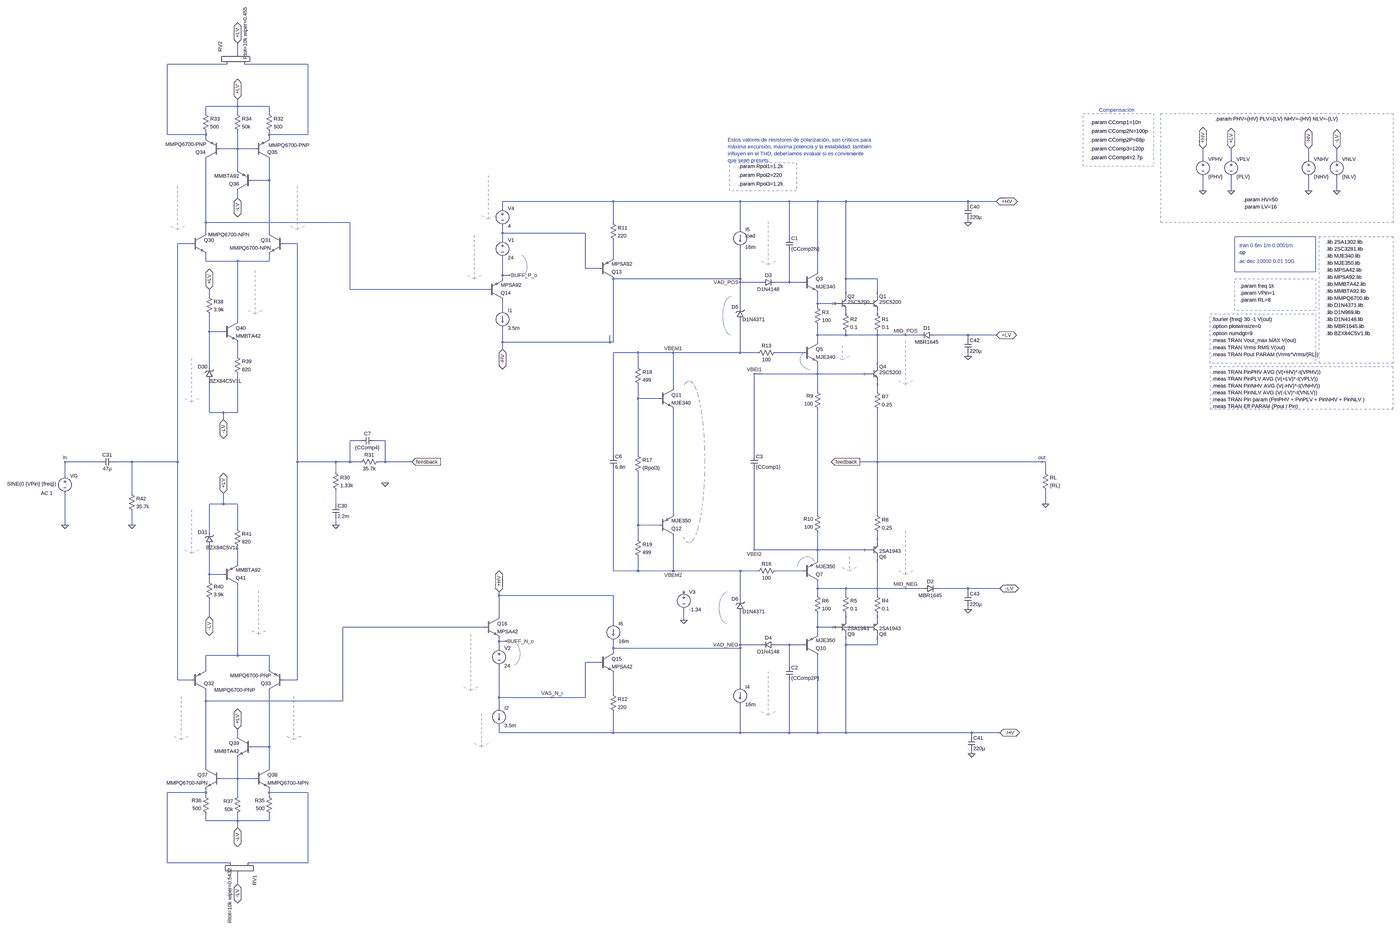
[diagram p0: schematic amplifier_V0.6_Test2.asc, whole sheet]
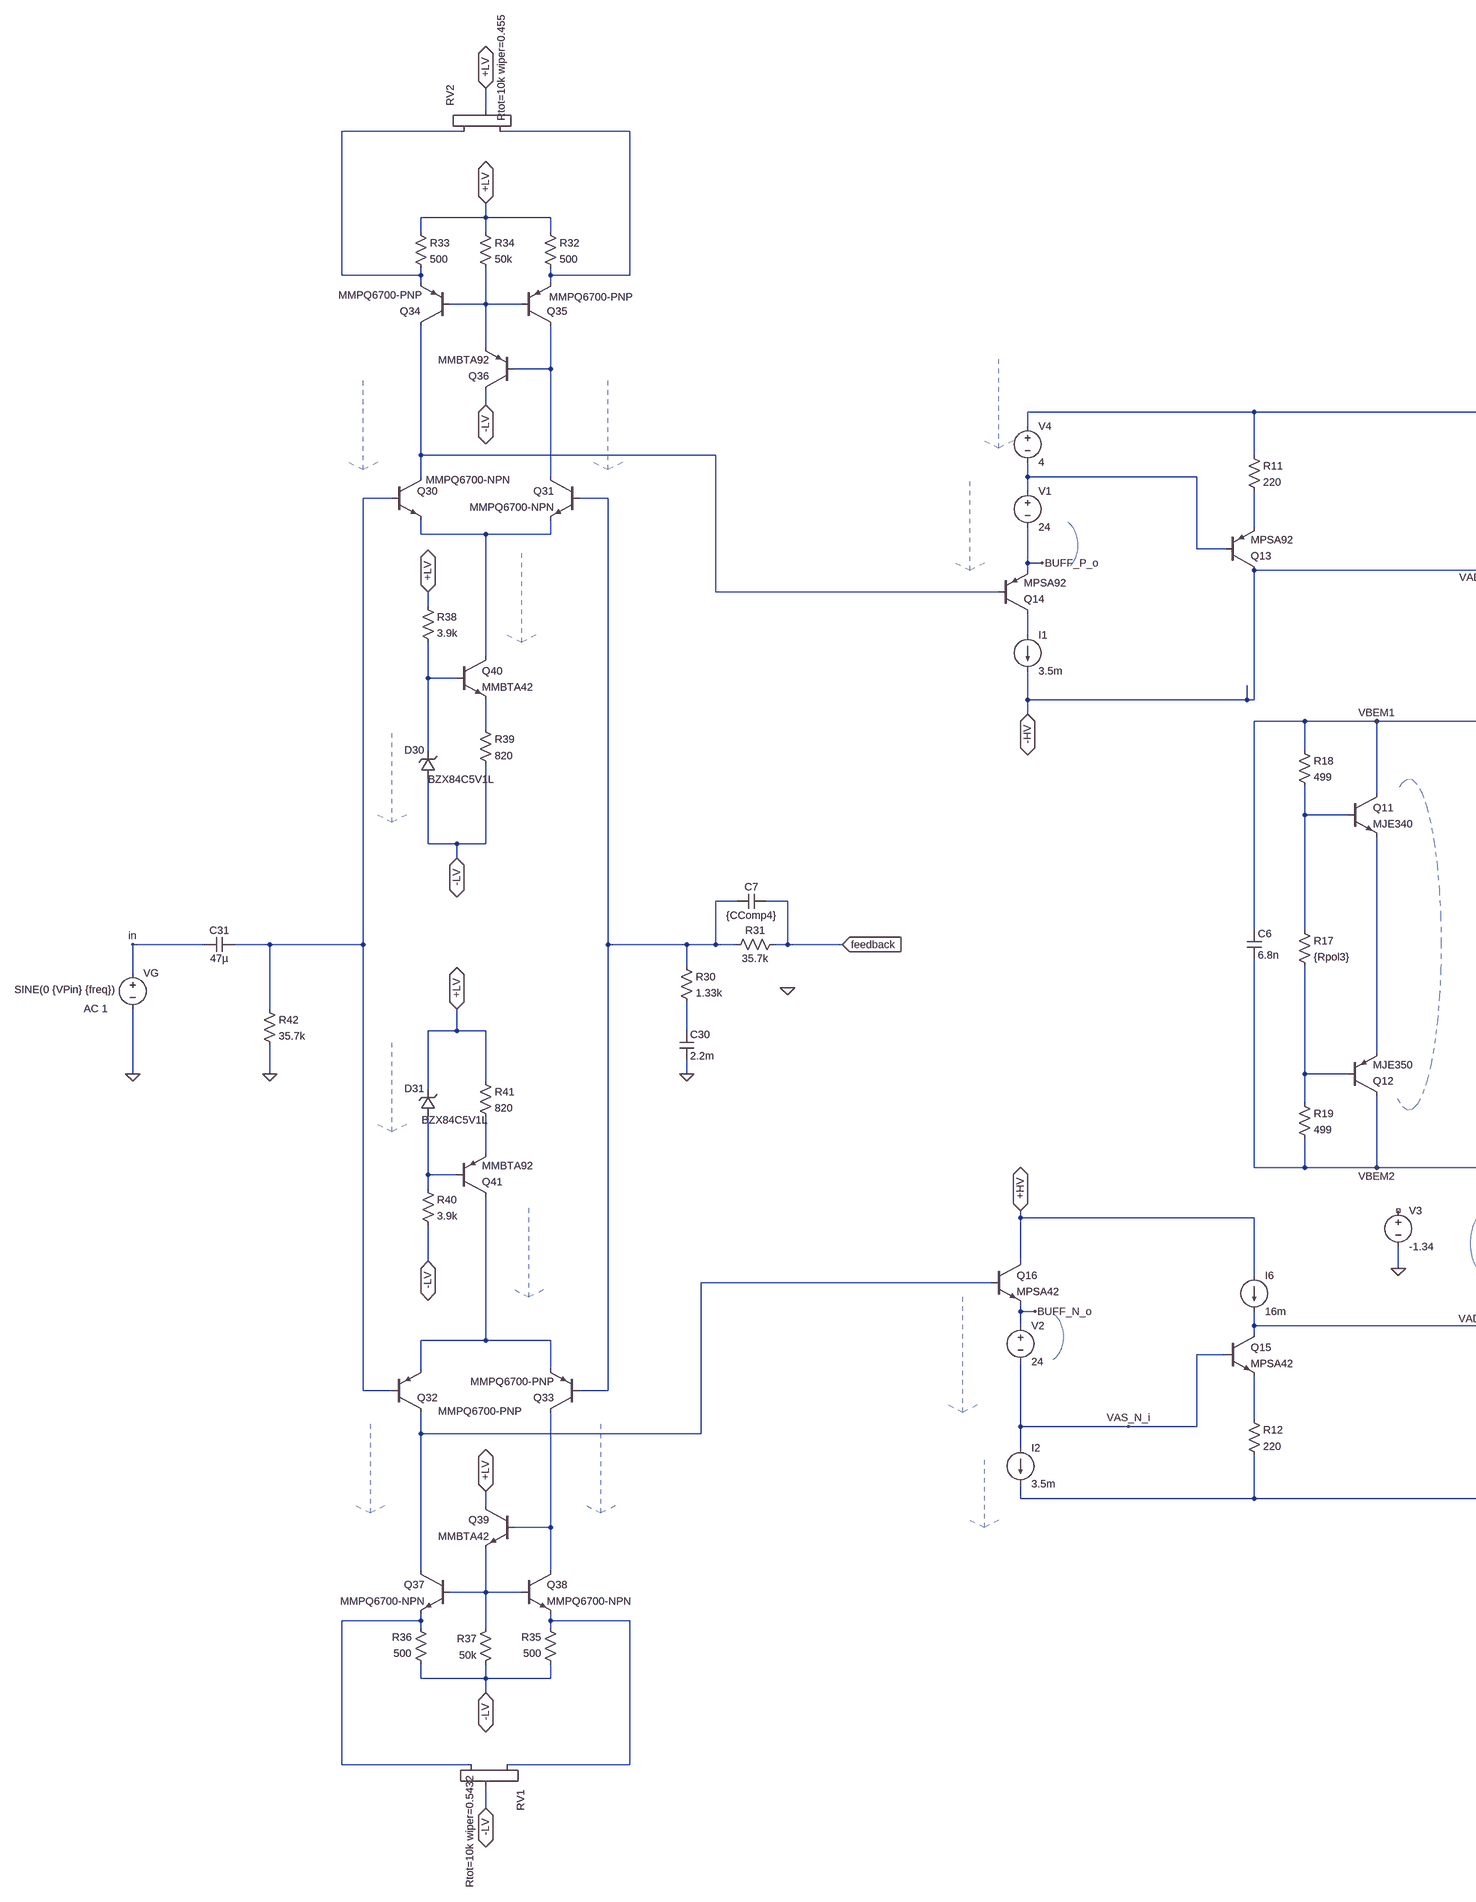
[diagram p1: schematic amplifier_V0.6_Test2.asc, part, row 1 of 1, column 1 of 2]
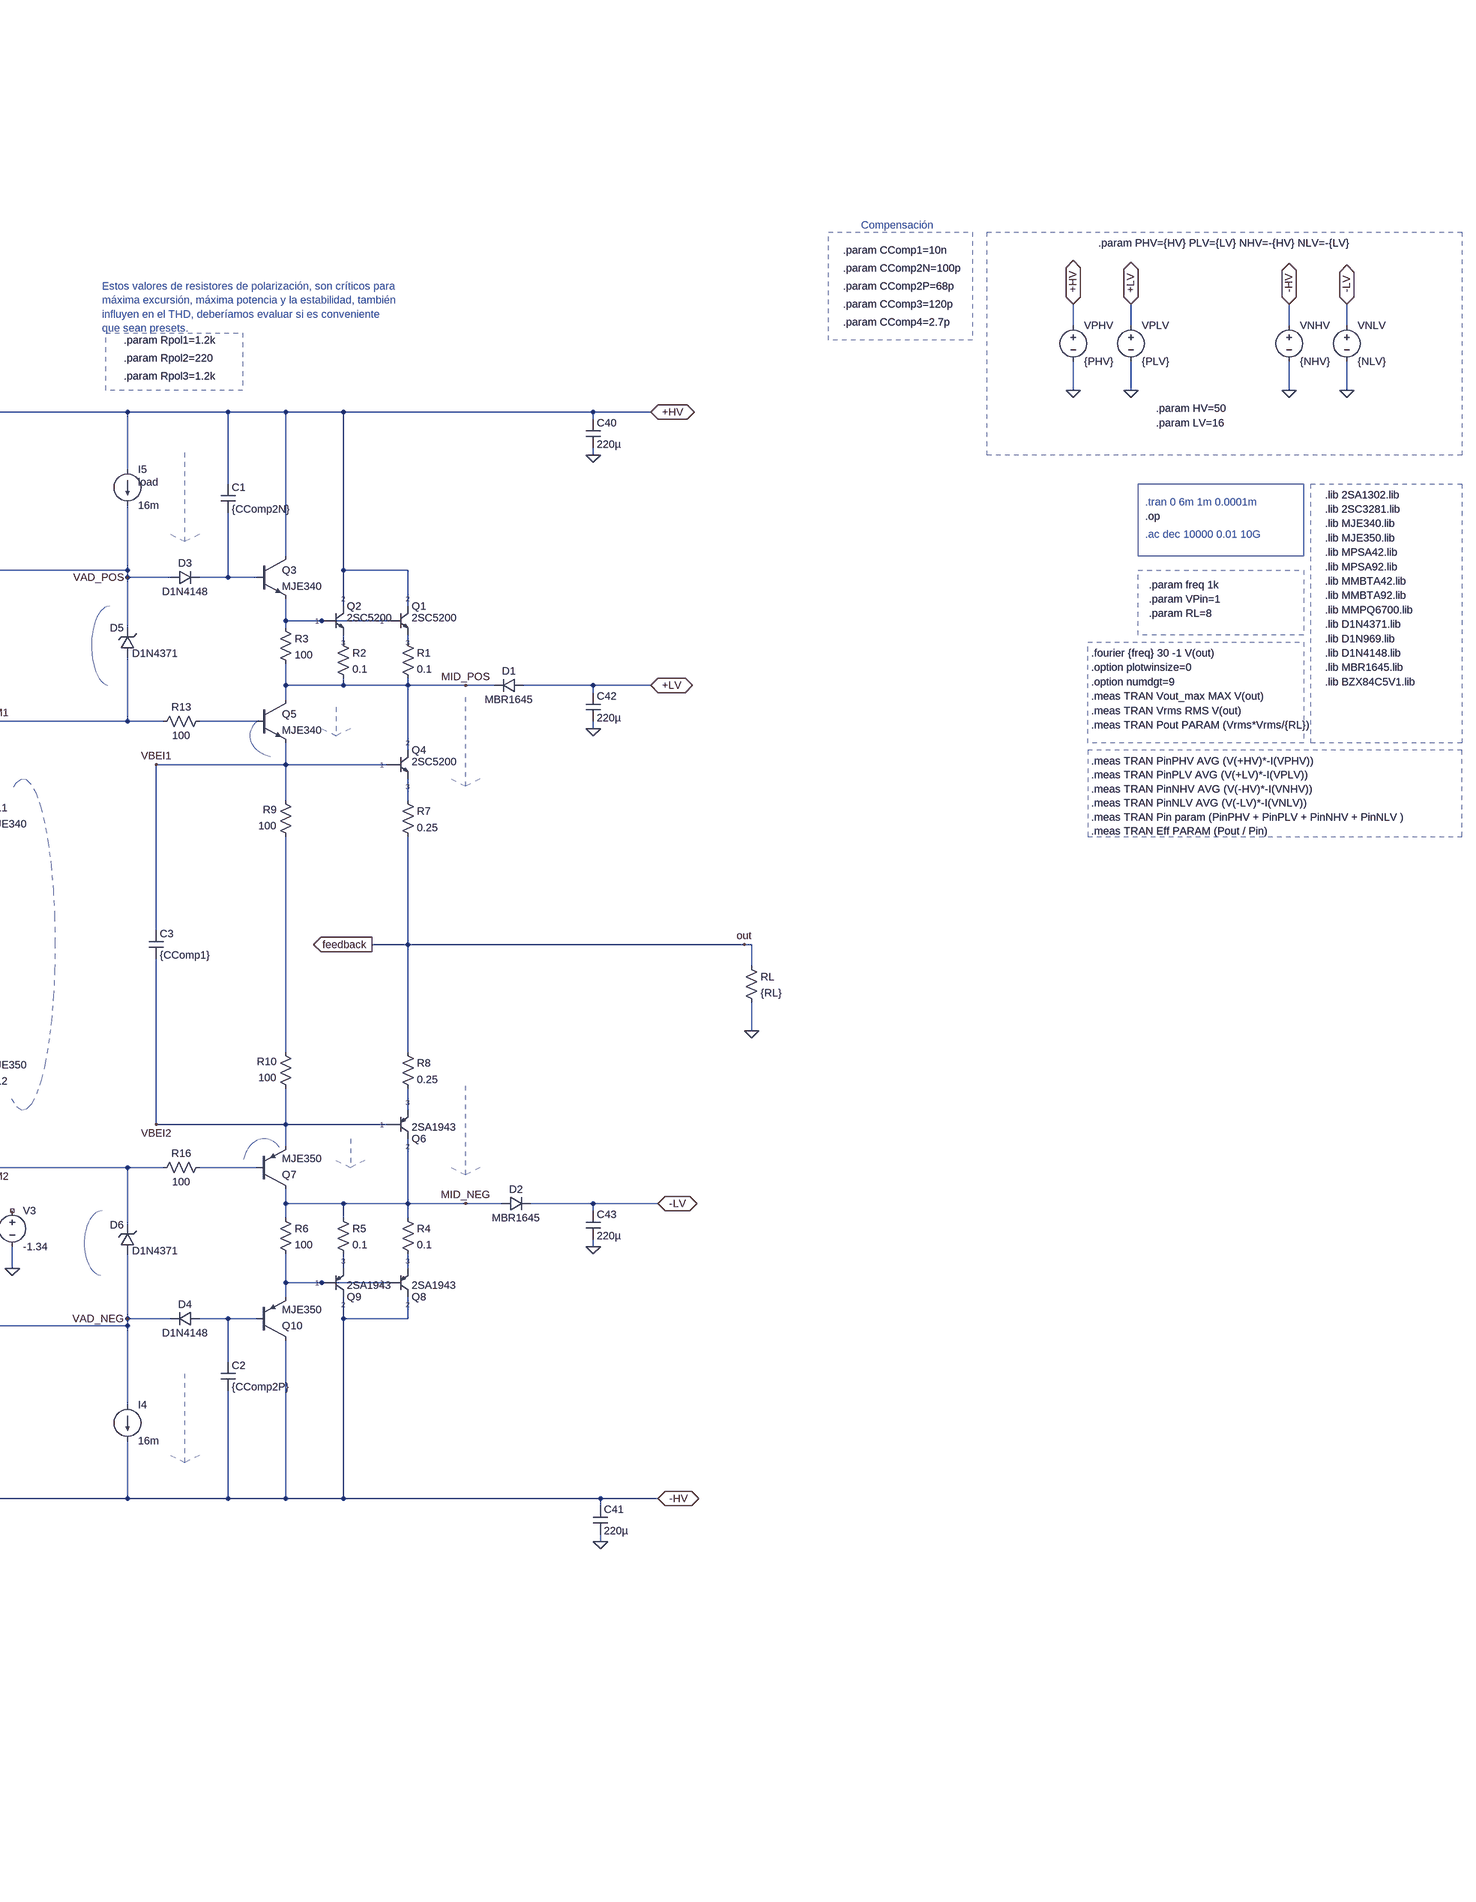
[diagram p2: schematic amplifier_V0.6_Test2.asc, part, row 1 of 1, column 2 of 2]
amplifier_V0.6_Test2.asc, the LTspice schematic file:
Version 4
SHEET 1 5124 2324
WIRE -2016 -1728 -2016 -1776
WIRE -2064 -1680 -2336 -1680
WIRE -1696 -1680 -1984 -1680
WIRE -2016 -1488 -2016 -1520
WIRE -2016 -1488 -2160 -1488
WIRE -1872 -1488 -2016 -1488
WIRE -2160 -1456 -2160 -1488
WIRE -2016 -1456 -2016 -1488
WIRE -1872 -1456 -1872 -1488
WIRE -2336 -1360 -2336 -1680
WIRE -2160 -1360 -2160 -1376
WIRE -2160 -1360 -2336 -1360
WIRE -1872 -1360 -1872 -1376
WIRE -1696 -1360 -1696 -1680
WIRE -1696 -1360 -1872 -1360
WIRE -2160 -1344 -2160 -1360
WIRE -1872 -1344 -1872 -1360
WIRE -2016 -1296 -2016 -1376
WIRE -2016 -1296 -2096 -1296
WIRE -1936 -1296 -2016 -1296
WIRE 4256 -1248 4256 -1296
WIRE 4384 -1248 4384 -1296
WIRE 4736 -1248 4736 -1296
WIRE 4864 -1248 4864 -1296
WIRE -2016 -1200 -2016 -1296
WIRE -1872 -1152 -1872 -1248
WIRE -1872 -1152 -1952 -1152
WIRE 4256 -1104 4256 -1168
WIRE 4384 -1104 4384 -1168
WIRE 4736 -1104 4736 -1168
WIRE 4864 -1104 4864 -1168
WIRE -2016 -1072 -2016 -1104
WIRE -128 -1056 -640 -1056
WIRE 448 -1056 -128 -1056
WIRE 672 -1056 448 -1056
WIRE 800 -1056 672 -1056
WIRE 928 -1056 800 -1056
WIRE 1712 -1056 928 -1056
WIRE 1840 -1056 1712 -1056
WIRE 1712 -1040 1712 -1056
WIRE -640 -1024 -640 -1056
WIRE -2160 -960 -2160 -1248
WIRE -1472 -960 -2160 -960
WIRE -128 -960 -128 -1056
WIRE 1712 -960 1712 -976
WIRE 448 -928 448 -1056
WIRE -2160 -912 -2160 -960
WIRE -1872 -912 -1872 -1152
WIRE -640 -912 -640 -944
WIRE -256 -912 -640 -912
WIRE 672 -896 672 -1056
WIRE -640 -880 -640 -912
WIRE -2224 -864 -2288 -864
WIRE -1744 -864 -1808 -864
WIRE -128 -800 -128 -880
WIRE -2160 -784 -2160 -816
WIRE -2016 -784 -2160 -784
WIRE -1872 -784 -1872 -816
WIRE -1872 -784 -2016 -784
WIRE -256 -752 -256 -912
WIRE -192 -752 -256 -752
WIRE 800 -736 800 -1056
WIRE -640 -720 -640 -800
WIRE -608 -720 -640 -720
WIRE -640 -704 -640 -720
WIRE 448 -704 448 -848
WIRE 448 -704 -128 -704
WIRE 928 -704 928 -1056
WIRE 1072 -704 928 -704
WIRE 448 -688 448 -704
WIRE 544 -688 448 -688
WIRE 672 -688 672 -832
WIRE 672 -688 608 -688
WIRE 736 -688 672 -688
WIRE -1472 -656 -1472 -960
WIRE -704 -656 -1472 -656
WIRE -2144 -624 -2144 -656
WIRE 928 -624 928 -704
WIRE 1072 -624 1072 -704
WIRE 800 -592 800 -640
WIRE 880 -592 800 -592
WIRE 1024 -592 880 -592
WIRE 448 -576 448 -688
WIRE 800 -576 800 -592
WIRE -640 -560 -640 -608
WIRE 928 -544 928 -560
WIRE 1072 -544 1072 -560
WIRE -2016 -512 -2016 -784
WIRE -2144 -464 -2144 -544
WIRE -2080 -464 -2144 -464
WIRE 800 -448 800 -496
WIRE 928 -448 928 -464
WIRE 928 -448 800 -448
WIRE 1072 -448 1072 -464
WIRE 1072 -448 928 -448
WIRE 1200 -448 1072 -448
WIRE 1264 -448 1200 -448
WIRE 1712 -448 1328 -448
WIRE 1840 -448 1712 -448
WIRE 1712 -432 1712 -448
WIRE -640 -416 -640 -480
WIRE -144 -416 -144 -448
WIRE -144 -416 -640 -416
WIRE -128 -416 -128 -704
WIRE -128 -416 -144 -416
WIRE 800 -416 800 -448
WIRE -640 -384 -640 -416
WIRE -16 -368 -128 -368
WIRE 144 -368 -16 -368
WIRE 448 -368 448 -512
WIRE 448 -368 144 -368
WIRE 528 -368 448 -368
WIRE 736 -368 608 -368
WIRE -2016 -352 -2016 -416
WIRE 1712 -352 1712 -368
WIRE -2144 -304 -2144 -464
WIRE -16 -304 -16 -368
WIRE 1072 -304 1072 -448
WIRE 800 -272 800 -320
WIRE 800 -272 512 -272
WIRE 1024 -272 800 -272
WIRE 144 -208 144 -368
WIRE 800 -192 800 -272
WIRE 1072 -192 1072 -240
WIRE -16 -160 -16 -224
WIRE 80 -160 -16 -160
WIRE -2144 -96 -2144 -240
WIRE -2080 -96 -2144 -96
WIRE -2016 -96 -2016 -272
WIRE -2016 -96 -2080 -96
WIRE -2080 -64 -2080 -96
WIRE -1424 32 -1472 32
WIRE -1312 32 -1360 32
WIRE -128 96 -128 -368
WIRE -16 96 -16 -160
WIRE 512 96 512 -272
WIRE -2640 128 -2912 128
WIRE -2496 128 -2576 128
WIRE -2288 128 -2288 -864
WIRE -2288 128 -2496 128
WIRE -1744 128 -1744 -864
WIRE -1536 128 -1744 128
WIRE -1472 128 -1472 32
WIRE -1472 128 -1536 128
WIRE -1424 128 -1472 128
WIRE -1312 128 -1312 32
WIRE -1312 128 -1344 128
WIRE -1152 128 -1312 128
WIRE 1072 128 1072 -112
WIRE 1072 128 992 128
WIRE 2048 128 1072 128
WIRE 2064 128 2048 128
WIRE -1536 176 -1536 128
WIRE 2064 176 2064 128
WIRE -2912 192 -2912 128
WIRE -2496 272 -2496 128
WIRE -2080 320 -2080 272
WIRE -2080 320 -2144 320
WIRE -2016 320 -2080 320
WIRE -1536 320 -1536 256
WIRE 2064 320 2064 256
WIRE 144 368 144 -112
WIRE 800 368 800 -112
WIRE 1072 368 1072 128
WIRE -2912 416 -2912 272
WIRE -2496 416 -2496 352
WIRE -1536 416 -1536 384
WIRE -16 416 -16 176
WIRE 80 416 -16 416
WIRE -2016 432 -2016 320
WIRE -2144 448 -2144 320
WIRE -16 480 -16 416
WIRE 1072 496 1072 448
WIRE 512 528 512 160
WIRE 800 528 800 448
WIRE 800 528 512 528
WIRE 1024 528 800 528
WIRE 800 576 800 528
WIRE -2016 592 -2016 512
WIRE -128 624 -128 160
WIRE -16 624 -16 560
WIRE -16 624 -128 624
WIRE 144 624 144 464
WIRE 144 624 -16 624
WIRE 448 624 144 624
WIRE 528 624 448 624
WIRE 736 624 608 624
WIRE -2144 640 -2144 512
WIRE -2080 640 -2144 640
WIRE -2144 672 -2144 640
WIRE 800 704 800 672
WIRE 928 704 800 704
WIRE 1072 704 1072 560
WIRE 1072 704 928 704
WIRE 1200 704 1072 704
WIRE 1280 704 1200 704
WIRE 1712 704 1344 704
WIRE 1856 704 1712 704
WIRE 1712 720 1712 704
WIRE -656 736 -656 720
WIRE -128 736 -656 736
WIRE 800 736 800 704
WIRE 928 736 928 704
WIRE 1072 736 1072 704
WIRE 448 752 448 624
WIRE 1712 800 1712 784
WIRE -2144 832 -2144 752
WIRE -656 832 -656 736
WIRE 192 848 192 800
WIRE 928 848 928 816
WIRE 1072 848 1072 816
WIRE -128 864 -128 736
WIRE -720 880 -1504 880
WIRE 800 880 800 816
WIRE 880 880 800 880
WIRE 1024 880 880 880
WIRE 800 912 800 880
WIRE -656 944 -656 928
WIRE -624 944 -656 944
WIRE 448 960 448 816
WIRE 544 960 448 960
WIRE 672 960 608 960
WIRE 736 960 672 960
WIRE 928 960 928 912
WIRE 1072 960 1072 912
WIRE 1072 960 928 960
WIRE -656 976 -656 944
WIRE -128 976 -128 944
WIRE 448 976 448 960
WIRE 448 976 -128 976
WIRE -128 992 -128 976
WIRE -2016 1008 -2016 688
WIRE -2016 1008 -2160 1008
WIRE -1872 1008 -2016 1008
WIRE -192 1040 -256 1040
WIRE 672 1056 672 960
WIRE -2160 1072 -2160 1008
WIRE -1872 1072 -1872 1008
WIRE -2288 1120 -2288 128
WIRE -2224 1120 -2288 1120
WIRE -1744 1120 -1744 128
WIRE -1744 1120 -1808 1120
WIRE 448 1152 448 976
WIRE -128 1184 -128 1088
WIRE -656 1200 -656 1056
WIRE -416 1200 -656 1200
WIRE -256 1200 -256 1040
WIRE -256 1200 -416 1200
WIRE -2160 1216 -2160 1168
WIRE -1504 1216 -1504 880
WIRE -1504 1216 -2160 1216
WIRE -656 1248 -656 1200
WIRE -656 1360 -656 1328
WIRE -128 1360 -128 1264
WIRE -128 1360 -656 1360
WIRE 448 1360 448 1232
WIRE 448 1360 -128 1360
WIRE 672 1360 672 1120
WIRE 672 1360 448 1360
WIRE 800 1360 800 1008
WIRE 800 1360 672 1360
WIRE 928 1360 928 960
WIRE 928 1360 800 1360
WIRE 1728 1360 928 1360
WIRE 1856 1360 1728 1360
WIRE -2016 1376 -2016 1344
WIRE 1728 1376 1728 1360
WIRE -1872 1424 -1872 1168
WIRE -1872 1424 -1952 1424
WIRE 1728 1456 1728 1440
WIRE -2160 1520 -2160 1216
WIRE -1872 1520 -1872 1424
WIRE -2016 1568 -2016 1472
WIRE -2016 1568 -2096 1568
WIRE -1936 1568 -2016 1568
WIRE -2160 1632 -2160 1616
WIRE -2160 1632 -2336 1632
WIRE -1872 1632 -1872 1616
WIRE -1696 1632 -1872 1632
WIRE -2160 1648 -2160 1632
WIRE -2016 1648 -2016 1568
WIRE -1872 1648 -1872 1632
WIRE -2160 1760 -2160 1728
WIRE -2016 1760 -2016 1728
WIRE -2016 1760 -2160 1760
WIRE -1872 1760 -1872 1728
WIRE -1872 1760 -2016 1760
WIRE -2016 1792 -2016 1760
WIRE -2336 1952 -2336 1632
WIRE -2048 1952 -2336 1952
WIRE -1696 1952 -1696 1632
WIRE -1696 1952 -1968 1952
WIRE -2016 2048 -2016 2000
FLAG 144 -368 VBEM1
FLAG 144 624 VBEM2
FLAG 448 -688 VAD_POS
FLAG 448 960 VAD_NEG
FLAG 1200 704 MID_NEG
FLAG 1200 -448 MID_POS
FLAG 512 -272 VBEI1
FLAG 512 528 VBEI2
FLAG -2496 416 0
FLAG -1536 416 0
FLAG -2016 -1520 +LV
IOPIN -2016 -1520 BiDir
FLAG -2016 1792 -LV
IOPIN -2016 1792 BiDir
FLAG -2016 1344 +LV
IOPIN -2016 1344 BiDir
FLAG -2016 -1072 -LV
IOPIN -2016 -1072 BiDir
FLAG -2144 -656 +LV
IOPIN -2144 -656 BiDir
FLAG -2080 -64 -LV
IOPIN -2080 -64 BiDir
FLAG -2080 272 +LV
IOPIN -2080 272 BiDir
FLAG -2144 832 -LV
IOPIN -2144 832 BiDir
FLAG 1856 1360 -HV
IOPIN 1856 1360 BiDir
FLAG 1856 704 -LV
IOPIN 1856 704 BiDir
FLAG 1840 -1056 +HV
IOPIN 1840 -1056 BiDir
FLAG 1840 -448 +LV
IOPIN 1840 -448 BiDir
FLAG 2064 320 0
FLAG 2048 128 out
FLAG -1152 128 feedback
IOPIN -1152 128 In
FLAG 992 128 feedback
IOPIN 992 128 Out
FLAG -2912 416 0
FLAG -2912 128 in
FLAG -608 -720 BUFF_P_o
FLAG -416 1200 VAS_N_i
FLAG -624 944 BUFF_N_o
FLAG 1712 -960 0
FLAG 1712 -352 0
FLAG 1712 800 0
FLAG 1728 1456 0
FLAG 4256 -1104 0
FLAG 4384 -1104 0
FLAG 4736 -1104 0
FLAG 4864 -1104 0
FLAG 4256 -1296 +HV
IOPIN 4256 -1296 BiDir
FLAG 4384 -1296 +LV
IOPIN 4384 -1296 BiDir
FLAG 4736 -1296 -HV
IOPIN 4736 -1296 BiDir
FLAG 4864 -1296 -LV
IOPIN 4864 -1296 BiDir
FLAG -2016 -1776 +LV
IOPIN -2016 -1776 BiDir
FLAG -2016 2048 -LV
IOPIN -2016 2048 BiDir
FLAG -640 -384 -HV
IOPIN -640 -384 BiDir
FLAG -656 720 +HV
IOPIN -656 720 BiDir
FLAG -1312 224 0
FLAG 192 848 0
DATAFLAG 848 704 "round($*100)/100"
DATAFLAG 1200 -304 "Ix(q4:2)"
DATAFLAG 1200 560 "-Ix(q6:2)"
DATAFLAG 288 128 "V(vbem1)-V(vbem2)"
DATAFLAG 912 -368 "-Ie(Q5)"
DATAFLAG 944 592 "Ie(Q7)"
DATAFLAG 144 -288 "Ic(Q11)"
DATAFLAG 144 544 "Ic(Q12)"
DATAFLAG 368 -496 "V(vad_pos)-V(vbem1)"
DATAFLAG 352 784 "-(V(vad_neg)-V(vbem2))"
DATAFLAG 736 -304 "V(vbem1)-V(vbei1)"
DATAFLAG 720 576 "-(V(vbem2)-V(vbei2))"
DATAFLAG 304 624 ""
DATAFLAG 288 -368 ""
DATAFLAG -768 -800 "Ie(Q14)"
DATAFLAG -528 1120 ""
DATAFLAG -944 -656 ""
DATAFLAG -1008 880 ""
DATAFLAG -1744 -1024 "Ic(Q31)"
DATAFLAG -2288 -1024 "Ic(Q30)"
DATAFLAG -2016 -784 ""
DATAFLAG -2272 1296 "-Ic(Q32)"
DATAFLAG -2016 1008 ""
DATAFLAG -2160 1328 ""
DATAFLAG -1760 1296 "-Ic(Q33)"
DATAFLAG -1872 1344 ""
DATAFLAG -2160 -1040 ""
DATAFLAG -1872 -1040 ""
DATAFLAG -2000 -1296 ""
DATAFLAG 1952 128 ""
DATAFLAG -2144 -480 ""
DATAFLAG -2016 -400 ""
DATAFLAG 800 144 ""
DATAFLAG -1584 128 ""
DATAFLAG -560 1008 "-V(VAS_N_i)+V(BUFF_N_o)"
DATAFLAG -1936 -640 "Ic(Q40)"
DATAFLAG -1920 816 "-Ic(Q41)"
DATAFLAG 800 -592 ""
DATAFLAG 672 960 ""
DATAFLAG -784 1008 "-Ie(Q16)"
DATAFLAG 144 80 ""
DATAFLAG -2224 -240 "Ix(D30:-)"
DATAFLAG -2224 448 "Ix(D31:-)"
DATAFLAG -2128 640 ""
DATAFLAG -704 -1072 "I(R12)"
DATAFLAG -736 1376 "I(R15)"
DATAFLAG -1248 128 ""
DATAFLAG 368 -1056 ""
DATAFLAG 576 -864 "Ic(Q17)"
DATAFLAG 240 1360 ""
DATAFLAG -560 1200 "Ib(Q15)"
DATAFLAG 576 1184 "-Ic(Q18)"
DATAFLAG 176 -720 "-Ic(Q13)"
DATAFLAG -320 -912 ""
DATAFLAG 320 -640 "V(VAD_POS)"
DATAFLAG -480 -960 "Ib(Q13)"
DATAFLAG -128 -688 ""
DATAFLAG -128 -848 ""
SYMBOL npn 736 -736 R0
SYMATTR InstName Q3
SYMATTR Value MJE340
SYMBOL res 784 -592 R0
SYMATTR InstName R3
SYMATTR Value 100
SYMBOL diode 544 -672 R270
WINDOW 0 32 32 VTop 2
WINDOW 3 0 32 VBottom 2
SYMATTR InstName D3
SYMATTR Value D1N4148
SYMBOL npn 736 -416 R0
SYMATTR InstName Q5
SYMATTR Value MJE340
SYMBOL res 1056 -208 R0
SYMATTR InstName R7
SYMATTR Value 0.25
SYMBOL res 816 -96 R180
WINDOW 0 36 76 Left 2
WINDOW 3 36 40 Left 2
SYMATTR InstName R9
SYMATTR Value 100
SYMBOL res 1056 352 R0
SYMATTR InstName R8
SYMATTR Value 0.25
SYMBOL pnp 736 672 M180
SYMATTR InstName Q7
SYMATTR Value MJE350
SYMBOL pnp 736 1008 M180
SYMATTR InstName Q10
SYMATTR Value MJE350
SYMBOL res 784 720 R0
SYMATTR InstName R6
SYMATTR Value 100
SYMBOL diode 608 944 R90
WINDOW 0 0 32 VBottom 2
WINDOW 3 32 32 VTop 2
SYMATTR InstName D4
SYMATTR Value D1N4148
SYMBOL diode 1280 720 R270
WINDOW 0 32 32 VTop 2
WINDOW 3 0 32 VBottom 2
SYMATTR InstName D2
SYMATTR Value MBR1645
SYMBOL res 816 464 R180
WINDOW 0 36 76 Left 2
WINDOW 3 36 40 Left 2
SYMATTR InstName R10
SYMATTR Value 100
SYMBOL res 1056 720 R0
SYMATTR InstName R4
SYMATTR Value 0.1
SYMBOL res 912 720 R0
SYMATTR InstName R5
SYMATTR Value 0.1
SYMBOL res 912 -560 R0
SYMATTR InstName R2
SYMATTR Value 0.1
SYMBOL res 1056 -560 R0
SYMATTR InstName R1
SYMATTR Value 0.1
SYMBOL diode 1328 -432 M270
WINDOW 0 32 32 VTop 2
WINDOW 3 0 32 VBottom 2
SYMATTR InstName D1
SYMATTR Value MBR1645
SYMBOL pnp 80 464 M180
SYMATTR InstName Q12
SYMATTR Value MJE350
SYMBOL npn 80 -208 R0
SYMATTR InstName Q11
SYMATTR Value MJE340
SYMBOL res -32 80 R0
SYMATTR InstName R17
SYMATTR Value {Rpol3}
SYMBOL res -32 -320 R0
SYMATTR InstName R18
SYMATTR Value 499
SYMBOL res -32 464 R0
SYMATTR InstName R19
SYMATTR Value 499
SYMBOL cap 496 96 R0
SYMATTR InstName C3
SYMATTR Value {CComp1}
SYMBOL res 624 -384 R90
WINDOW 0 0 56 VBottom 2
WINDOW 3 32 56 VTop 2
SYMATTR InstName R13
SYMATTR Value 100
SYMBOL res 624 608 R90
WINDOW 0 0 56 VBottom 2
WINDOW 3 32 56 VTop 2
SYMATTR InstName R16
SYMATTR Value 100
SYMBOL cap -144 96 R0
SYMATTR InstName C6
SYMATTR Value 6.8n
SYMBOL npn -720 832 R0
SYMATTR InstName Q16
SYMATTR Value MPSA42
SYMBOL res -1552 160 R0
SYMATTR InstName R30
SYMATTR Value 1.33k
SYMBOL res -1328 112 R90
WINDOW 0 0 56 VBottom 2
WINDOW 3 32 56 VTop 2
SYMATTR InstName R31
SYMATTR Value 35.7k
SYMBOL res -2512 256 R0
SYMATTR InstName R42
SYMATTR Value 35.7k
SYMBOL cap -1552 320 R0
SYMATTR InstName C30
SYMATTR Value 2.2m
SYMBOL cap -2576 112 R90
WINDOW 0 0 32 VBottom 2
WINDOW 3 32 32 VTop 2
SYMATTR InstName C31
SYMATTR Value 47µ
SYMBOL pnp -704 -608 M180
SYMATTR InstName Q14
SYMATTR Value MPSA92
SYMBOL npn -2224 -912 R0
WINDOW 3 75 7 Left 2
SYMATTR Value MMPQ6700-NPN
SYMATTR InstName Q30
SYMBOL npn -1808 -912 M0
SYMATTR InstName Q31
SYMATTR Value MMPQ6700-NPN
SYMBOL pnp -2224 1168 M180
WINDOW 3 102 2 Left 2
SYMATTR Value MMPQ6700-PNP
SYMATTR InstName Q32
SYMBOL pnp -1808 1168 R180
SYMATTR InstName Q33
SYMATTR Value MMPQ6700-PNP
SYMBOL pnp -1936 -1248 M180
WINDOW 3 61 64 Left 2
SYMATTR Value MMPQ6700-PNP
SYMATTR InstName Q35
SYMBOL pnp -2096 -1248 R180
WINDOW 0 65 32 Left 2
WINDOW 3 61 68 Left 2
SYMATTR InstName Q34
SYMATTR Value MMPQ6700-PNP
SYMBOL npn -2096 1520 M0
SYMATTR InstName Q37
SYMATTR Value MMPQ6700-NPN
SYMBOL npn -1936 1520 R0
SYMATTR InstName Q38
SYMATTR Value MMPQ6700-NPN
SYMBOL res -2176 -1472 R0
SYMATTR InstName R33
SYMATTR Value 500
SYMBOL res -1888 -1472 R0
SYMATTR InstName R32
SYMATTR Value 500
SYMBOL res -1856 1744 R180
WINDOW 0 36 76 Left 2
WINDOW 3 36 40 Left 2
SYMATTR InstName R35
SYMATTR Value 500
SYMBOL res -2144 1744 R180
WINDOW 0 36 76 Left 2
WINDOW 3 36 40 Left 2
SYMATTR InstName R36
SYMATTR Value 500
SYMBOL npn -1952 1376 M0
SYMATTR InstName Q39
SYMATTR Value MMBTA42
SYMBOL pnp -1952 -1104 R180
SYMATTR InstName Q36
SYMATTR Value MMBTA92
SYMBOL res -2000 1632 M0
SYMATTR InstName R37
SYMATTR Value 50k
SYMBOL res -2032 -1472 R0
SYMATTR InstName R34
SYMATTR Value 50k
SYMBOL 2SC5200 896 -608 R0
SYMATTR InstName Q2
SYMBOL 2SC5200 1040 -608 R0
SYMATTR InstName Q1
SYMBOL 2SC5200 1040 -288 R0
SYMATTR InstName Q4
SYMBOL 2SA1943 1040 544 M180
SYMATTR InstName Q6
SYMBOL 2SA1943 896 896 M180
SYMATTR InstName Q9
SYMBOL 2SA1943 1040 896 M180
SYMATTR InstName Q8
SYMBOL res -2160 -640 R0
SYMATTR InstName R38
SYMATTR Value 3.9k
SYMBOL npn -2080 -512 R0
SYMATTR InstName Q40
SYMATTR Value MMBTA42
SYMBOL res -2032 -368 R0
SYMATTR InstName R39
SYMATTR Value 820
SYMBOL pnp -2080 688 M180
SYMATTR InstName Q41
SYMATTR Value MMBTA92
SYMBOL res -2032 416 R0
SYMATTR InstName R41
SYMATTR Value 820
SYMBOL res -2160 656 R0
SYMATTR InstName R40
SYMATTR Value 3.9k
SYMBOL res 2048 160 R0
SYMATTR InstName RL
SYMATTR Value {RL}
SYMBOL cap 656 1056 R0
SYMATTR InstName C2
SYMATTR Value {CComp2P}
SYMBOL cap 656 -896 R0
SYMATTR InstName C1
SYMATTR Value {CComp2N}
SYMBOL voltage -2912 176 R0
WINDOW 3 -263 52 Left 2
WINDOW 123 -109 95 Left 2
WINDOW 39 0 0 Left 2
SYMATTR Value SINE(0 {VPin} {freq})
SYMATTR Value2 AC 1
SYMATTR InstName VG
SYMBOL zener 464 -512 R180
WINDOW 0 24 64 Left 2
WINDOW 3 -96 7 Left 2
SYMATTR InstName D5
SYMATTR Value D1N4371
SYMBOL zener 464 816 R180
WINDOW 0 24 64 Left 2
WINDOW 3 -96 7 Left 2
SYMATTR InstName D6
SYMATTR Value D1N4371
SYMBOL cap 1696 -1040 R0
SYMATTR InstName C40
SYMATTR Value 220µ
SYMBOL cap 1696 -432 R0
SYMATTR InstName C42
SYMATTR Value 220µ
SYMBOL cap 1696 720 R0
SYMATTR InstName C43
SYMATTR Value 220µ
SYMBOL cap 1712 1376 R0
SYMATTR InstName C41
SYMATTR Value 220µ
SYMBOL zener -2128 -240 R180
WINDOW 0 24 64 Left 2
WINDOW 3 -131 -1 Left 2
SYMATTR InstName D30
SYMATTR Value BZX84C5V1L
SYMATTR Prefix X
SYMBOL zener -2128 512 R180
WINDOW 0 24 64 Left 2
WINDOW 3 -117 -6 Left 2
SYMATTR InstName D31
SYMATTR Value BZX84C5V1L
SYMATTR Prefix X
SYMBOL voltage 4256 -1264 R0
SYMATTR InstName VPHV
SYMATTR Value {PHV}
SYMBOL voltage 4384 -1264 R0
SYMATTR InstName VPLV
SYMATTR Value {PLV}
SYMBOL voltage 4736 -1264 R0
SYMATTR InstName VNHV
SYMATTR Value {NHV}
SYMBOL voltage 4864 -1264 R0
SYMATTR InstName VNLV
SYMATTR Value {NLV}
SYMBOL potentiometer_standard -1952 1936 R90
WINDOW 3 39 99 Left 2
SYMATTR Value Rtot=10k wiper=0.5432
SYMATTR InstName RV1
SYMATTR SpiceLine ""
SYMBOL potentiometer_standard -2080 -1664 R270
WINDOW 3 39 99 Left 2
SYMATTR Value Rtot=10k wiper=0.455
SYMATTR InstName RV2
SYMATTR SpiceLine ""
SYMBOL cap -1360 16 R90
WINDOW 0 0 32 VBottom 2
WINDOW 3 32 32 VTop 2
SYMATTR InstName C7
SYMATTR Value {CComp4}
SYMBOL current -640 -560 R0
SYMATTR InstName I1
SYMATTR Value 3.5m
SYMBOL current -656 1248 R0
SYMATTR InstName I2
SYMATTR Value 3.5m
SYMBOL current 448 1152 R0
SYMATTR InstName I4
SYMATTR Value 16m
SYMBOL voltage -640 -896 R0
SYMATTR InstName V1
SYMATTR Value 24
SYMBOL voltage -656 960 R0
SYMATTR InstName V2
SYMATTR Value 24
SYMBOL pnp -192 -704 M180
SYMATTR InstName Q13
SYMATTR Value MPSA92
SYMBOL res -144 -976 R0
SYMATTR InstName R11
SYMATTR Value 220
SYMBOL res -144 1168 R0
SYMATTR InstName R12
SYMATTR Value 220
SYMBOL npn -192 992 R0
SYMATTR InstName Q15
SYMATTR Value MPSA42
SYMBOL current -128 864 R0
SYMATTR InstName I6
SYMATTR Value 16m
SYMBOL voltage 192 704 R0
SYMATTR InstName V3
SYMATTR Value -1.34
SYMBOL current 448 -928 R0
WINDOW 123 0 0 Left 0
WINDOW 39 24 28 Left 2
SYMATTR InstName I5
SYMATTR Value 16m
SYMATTR SpiceLine load
SYMBOL voltage -640 -1040 R0
SYMATTR InstName V4
SYMATTR Value 4
TEXT 4416 -856 Left 2 ;.tran 0 6m 1m 0.0001m
TEXT 4424 -672 Left 2 !.param freq 1k
TEXT 4416 -824 Left 2 !.op
TEXT 4296 -520 Left 2 !.fourier {freq} 30 -1 V(out)
TEXT 4816 -872 Left 2 !.lib 2SA1302.lib
TEXT 4816 -840 Left 2 !.lib 2SC3281.lib
TEXT 4816 -584 Left 2 !.lib D1N4371.lib
TEXT 4816 -488 Left 2 !.lib MBR1645.lib
TEXT 4816 -808 Left 2 !.lib MJE340.lib
TEXT 4816 -776 Left 2 !.lib MJE350.lib
TEXT 4816 -520 Left 2 !.lib D1N4148.lib
TEXT 4816 -744 Left 2 !.lib MPSA42.lib
TEXT 4816 -712 Left 2 !.lib MPSA92.lib
TEXT 4816 -552 Left 2 !.lib D1N969.lib
TEXT 4416 -784 Left 2 ;.ac dec 10000 0.01 10G
TEXT 4424 -640 Left 2 !.param VPin=1
TEXT 4816 -456 Left 2 !.lib BZX84C5V1.lib
TEXT 4816 -680 Left 2 !.lib MMBTA42.lib
TEXT 4816 -648 Left 2 !.lib MMBTA92.lib
TEXT 4816 -616 Left 2 !.lib MMPQ6700.lib
TEXT 4296 -488 Left 2 !.option plotwinsize=0
TEXT 4296 -392 Left 2 !.meas TRAN Vrms RMS V(out)
TEXT 4296 -360 Left 2 !.meas TRAN Pout PARAM (Vrms*Vrms/{RL})
TEXT 4296 -456 Left 2 !.option numdgt=9
TEXT 4296 -424 Left 2 !.meas TRAN Vout_max MAX V(out)
TEXT 4424 -608 Left 2 !.param RL=8
TEXT 4296 -280 Left 2 !.meas TRAN PinPHV AVG (V(+HV)*-I(VPHV))\n.meas TRAN PinPLV AVG (V(+LV)*-I(VPLV))\n.meas TRAN PinNHV AVG (V(-HV)*-I(VNHV))\n.meas TRAN PinNLV AVG (V(-LV)*-I(VNLV))\n.meas TRAN Pin param (PinPHV + PinPLV + PinNHV + PinNLV )\n.meas TRAN Eff PARAM (Pout / Pin)
TEXT 4312 -1432 Left 2 !.param PHV={HV} PLV={LV} NHV=-{HV} NLV=-{LV}
TEXT 4440 -1064 Left 2 !.param HV=50
TEXT 4440 -1032 Left 2 !.param LV=16
TEXT 440 -1216 Left 2 !.param Rpol1=1.2k
TEXT 440 -1176 Left 2 !.param Rpol2=220
TEXT 440 -1136 Left 2 !.param Rpol3=1.2k
TEXT 392 -1336 Left 2 ;Estos valores de resistores de polarización, son críticos para\nmáxima excursión, máxima potencia y la estabilidad, también\ninfluyen en el THD, deberíamos evaluar si es conveniente\nque sean presets.
TEXT 3744 -1416 Left 2 !.param CComp1=10n
TEXT 3744 -1376 Left 2 !.param CComp2N=100p
TEXT 3744 -1296 Left 2 !.param CComp3=120p
TEXT 3784 -1472 Left 2 ;Compensación
TEXT 3744 -1336 Left 2 !.param CComp2P=68p
TEXT 3744 -1256 Left 2 !.param CComp4=2.7p
LINE Normal -768 -704 -768 -912 2
LINE Normal 1200 -224 1200 -432 2
LINE Normal 1232 -240 1200 -224 2
LINE Normal 1168 -240 1200 -224 2
LINE Normal 1200 640 1200 432 2
LINE Normal 1232 624 1200 640 2
LINE Normal 1168 624 1200 640 2
LINE Normal 944 -352 912 -336 2
LINE Normal 880 -352 912 -336 2
LINE Normal 912 -400 912 -336 2
LINE Normal 976 608 944 624 2
LINE Normal 912 608 944 624 2
LINE Normal 944 560 944 624 2
LINE Normal -1744 -928 -1744 -1136 2
LINE Normal -1712 -944 -1744 -928 2
LINE Normal -1776 -944 -1744 -928 2
LINE Normal -2288 -928 -2288 -1136 2
LINE Normal -2256 -944 -2288 -928 2
LINE Normal -2320 -944 -2288 -928 2
LINE Normal -2272 1392 -2272 1184 2
LINE Normal -2240 1376 -2272 1392 2
LINE Normal -2304 1376 -2272 1392 2
LINE Normal -1760 1392 -1760 1184 2
LINE Normal -1728 1376 -1760 1392 2
LINE Normal -1792 1376 -1760 1392 2
LINE Normal -800 -720 -768 -704 2
LINE Normal -736 -720 -768 -704 2
LINE Normal -1936 -544 -1936 -752 2
LINE Normal -1968 -560 -1936 -544 2
LINE Normal -1904 -560 -1936 -544 2
LINE Normal -1920 912 -1920 704 2
LINE Normal -1952 896 -1920 912 2
LINE Normal -1888 896 -1920 912 2
LINE Normal -784 1168 -784 912 2
LINE Normal -752 1152 -784 1168 2
LINE Normal -816 1152 -784 1168 2
LINE Normal -2224 -144 -2224 -352 2
LINE Normal -2256 -160 -2224 -144 2
LINE Normal -2192 -160 -2224 -144 2
LINE Normal -2224 544 -2224 336 2
LINE Normal -2256 528 -2224 544 2
LINE Normal -2192 528 -2224 544 2
LINE Normal -704 -976 -704 -1184 2
LINE Normal -736 -992 -704 -976 2
LINE Normal -672 -992 -704 -976 2
LINE Normal -736 1424 -736 1264 2
LINE Normal -768 1408 -736 1424 2
LINE Normal -704 1408 -736 1424 2
LINE Normal 608 -784 576 -768 2
LINE Normal 544 -784 576 -768 2
LINE Normal 576 -768 576 -976 2
LINE Normal 608 1264 576 1280 2
LINE Normal 544 1264 576 1280 2
LINE Normal 576 1280 576 1072 2
RECTANGLE Normal 4768 -736 4400 -896
RECTANGLE Normal 4768 -560 4400 -704 3
RECTANGLE Normal 5120 -320 4784 -896 2
RECTANGLE Normal 4768 -320 4288 -544 3
RECTANGLE Normal 4288 -112 5120 -304 3
RECTANGLE Normal 5120 -960 4064 -1456 4
RECTANGLE Normal 704 -1104 400 -1232 2
RECTANGLE Normal 4032 -1216 3712 -1456 1
ARC Normal 720 -384 848 -288 723 -382 752 -253 3
ARC Normal 800 560 704 688 798 563 669 592 3
ARC Normal 144 -240 288 496 189 485 187 -235 2
ARC Normal 432 720 352 864 392 712 388 870 2
ARC Normal 448 -624 368 -448 408 -632 404 -442 2
ARC Normal -528 -704 -608 -816 -528 -685 -550 -816 2
ARC Normal -560 1056 -640 944 -560 1123 -582 944 2

The netlist it stands for:
* amplifier_V0.6_Test2.asc
Q3 +HV N011 N012 0 MJE340
R3 N012 MID_POS 100
D3 -HV N011 D1N4148
Q5 MID_POS N017 VBEI1 0 MJE340
R7 N019 feedback 0.25
R9 N023 VBEI1 100
R8 feedback N025 0.25
Q7 MID_NEG N027 VBEI2 0 MJE350
Q10 -HV N033 N032 0 MJE350
R6 MID_NEG N032 100
D4 N033 VAD_NEG D1N4148
D2 MID_NEG -LV MBR1645
R10 VBEI2 N023 100
R4 MID_NEG N030 0.1
R5 MID_NEG N029 0.1
R2 N014 MID_POS 0.1
R1 N015 MID_POS 0.1
D1 +LV MID_POS MBR1645
Q12 VBEM2 N024 N022 0 MJE350
Q11 VBEM1 N020 N022 0 MJE340
R17 N020 N024 {Rpol3}
R18 VBEM1 N020 499
R19 N024 VBEM2 499
C3 VBEI1 VBEI2 {CComp1}
R13 N017 VBEM1 100
R16 N027 VBEM2 100
C6 VBEM1 VBEM2 6.8n
Q16 +HV N031 BUFF_N_o 0 MPSA42
R30 N008 N021 1.33k
R31 feedback N008 35.7k
R42 N007 0 35.7k
C30 N021 0 2.2m
C31 N007 in 47µ
Q14 N013 N005 BUFF_P_o 0 MPSA92
Q30 N005 N007 N010 0 MMPQ6700-NPN
Q31 N004 N008 N010 0 MMPQ6700-NPN
Q32 N031 N007 N034 0 MMPQ6700-PNP
Q33 N036 N008 N034 0 MMPQ6700-PNP
Q35 N004 N003 N002 0 MMPQ6700-PNP
Q34 N005 N003 N001 0 MMPQ6700-PNP
Q37 N031 N037 N038 0 MMPQ6700-NPN
Q38 N036 N037 N039 0 MMPQ6700-NPN
R33 +LV N001 500
R32 +LV N002 500
R35 -LV N039 500
R36 -LV N038 500
Q39 +LV N036 N037 0 MMBTA42
Q36 -LV N004 N003 0 MMBTA92
R37 N037 -LV 50k
R34 +LV N003 50k
XQ2 +HV N012 N014 2SC5200  ; pins 2 1 3
XQ1 +HV N012 N015 2SC5200  ; pins 2 1 3
XQ4 MID_POS VBEI1 N019 2SC5200  ; pins 2 1 3
XQ6 MID_NEG VBEI2 N025 2SA1943  ; pins 2 1 3
XQ9 -HV N032 N029 2SA1943  ; pins 2 1 3
XQ8 -HV N032 N030 2SA1943  ; pins 2 1 3
R38 +LV N016 3.9k
Q40 N010 N016 N018 0 MMBTA42
R39 N018 -LV 820
Q41 N034 N028 N026 0 MMBTA92
R41 +LV N026 820
R40 N028 -LV 3.9k
RL feedback 0 {RL}
C2 N033 -HV {CComp2P}
C1 +HV N011 {CComp2N}
VG in 0 SINE(0 {VPin} {freq}) AC 1
D5 VBEM1 -HV D1N4371
D6 VAD_NEG VBEM2 D1N4371
C40 +HV 0 220µ
C42 +LV 0 220µ
C43 -LV 0 220µ
C41 -HV 0 220µ
XD30 -LV N016 BZX84C5V1L  ; pins + -
XD31 N028 +LV BZX84C5V1L  ; pins + -
VPHV +HV 0 {PHV}
VPLV +LV 0 {PLV}
VNHV -HV 0 {NHV}
VNLV -LV 0 {NLV}
XRV1 N039 N038 -LV Rtot=10k wiper=0.5432
XRV2 N001 N002 +LV Rtot=10k wiper=0.455
C7 feedback N008 {CComp4}
I1 N013 -HV 3.5m
I2 VAS_N_i -HV 3.5m
I4 VAD_NEG -HV 16m
V1 N006 BUFF_P_o 24
V2 BUFF_N_o VAS_N_i 24
Q13 -HV N006 N009 0 MPSA92
R11 +HV N009 220
R12 N035 -HV 220
Q15 VAD_NEG VAS_N_i N035 0 MPSA42
I6 +HV VAD_NEG 16m
V3 NC_01 0 -1.34
I5 +HV -HV 16m load
V4 +HV N006 4
.model D D
.lib standard.dio
.model NPN NPN
.model PNP PNP
.lib standard.bjt
* .tran 0 6m 1m 0.0001m
.param freq 1k
.op
.fourier {freq} 30 -1 V(out)
.lib 2SA1302.lib
.lib 2SC3281.lib
.lib D1N4371.lib
.lib MBR1645.lib
.lib MJE340.lib
.lib MJE350.lib
.lib D1N4148.lib
.lib MPSA42.lib
.lib MPSA92.lib
.lib D1N969.lib
* .ac dec 10000 0.01 10G
.param VPin=1
.lib BZX84C5V1.lib
.lib MMBTA42.lib
.lib MMBTA92.lib
.lib MMPQ6700.lib
.option plotwinsize=0
.meas TRAN Vrms RMS V(out)
.meas TRAN Pout PARAM (Vrms*Vrms/{RL})
.option numdgt=9
.meas TRAN Vout_max MAX V(out)
.param RL=8
.meas TRAN PinPHV AVG (V(+HV)*-I(VPHV))
.meas TRAN PinPLV AVG (V(+LV)*-I(VPLV))
.meas TRAN PinNHV AVG (V(-HV)*-I(VNHV))
.meas TRAN PinNLV AVG (V(-LV)*-I(VNLV))
.meas TRAN Pin param (PinPHV + PinPLV + PinNHV + PinNLV )
.meas TRAN Eff PARAM (Pout / Pin)
.param PHV={HV} PLV={LV} NHV=-{HV} NLV=-{LV}
.param HV=50
.param LV=16
.param Rpol1=1.2k
.param Rpol2=220
.param Rpol3=1.2k
* Estos valores de resistores de polarización, son críticos para
* máxima excursión, máxima potencia y la estabilidad, también
* influyen en el THD, deberíamos evaluar si es conveniente
* que sean presets.
.param CComp1=10n
.param CComp2N=100p
.param CComp3=120p
* Compensación
.param CComp2P=68p
.param CComp4=2.7p
.lib 2SC5200.mod
.lib 2SA1943.mod
.backanno
.end